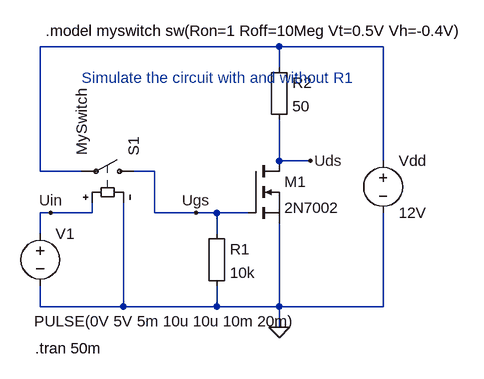
[diagram p0: schematic FET-switch-gate-protection-R.asc]
FET-switch-gate-protection-R.asc, the LTspice schematic file:
Version 4
SHEET 1 880 680
WIRE 256 48 -112 48
WIRE 416 48 256 48
WIRE 256 80 256 48
WIRE 256 224 256 160
WIRE 304 224 256 224
WIRE 416 224 416 48
WIRE -112 240 -112 48
WIRE -48 240 -112 240
WIRE 64 240 32 240
WIRE -96 304 -112 304
WIRE -32 304 -32 288
WIRE -32 304 -96 304
WIRE 64 304 64 240
WIRE 128 304 64 304
WIRE 160 304 128 304
WIRE 208 304 160 304
WIRE -112 336 -112 304
WIRE 160 336 160 304
WIRE -112 448 -112 416
WIRE 16 448 16 288
WIRE 16 448 -112 448
WIRE 160 448 160 416
WIRE 160 448 16 448
WIRE 256 448 256 320
WIRE 256 448 160 448
WIRE 416 448 416 304
WIRE 416 448 256 448
WIRE 256 480 256 448
FLAG 256 480 0
FLAG 128 304 Ugs
FLAG 304 224 Uds
FLAG -96 304 Uin
SYMBOL voltage 416 208 R0
WINDOW 123 0 0 Left 0
WINDOW 39 0 0 Left 0
SYMATTR InstName Vdd
SYMATTR Value 12V
SYMBOL nmos 208 224 R0
SYMATTR InstName M1
SYMATTR Value 2N7002
SYMBOL voltage -112 320 R0
WINDOW 3 -9 151 Left 2
WINDOW 123 0 0 Left 0
WINDOW 39 -9 169 Left 2
SYMATTR Value PULSE(0V 5V 5m 10u 10u 10m 20m)
SYMATTR InstName V1
SYMBOL Misc\\EuropeanResistor 144 320 R0
SYMATTR InstName R1
SYMATTR Value 10k
SYMBOL sw 48 240 M270
SYMATTR InstName S1
SYMATTR Value MySwitch
SYMBOL Misc\\EuropeanResistor 240 64 R0
SYMATTR InstName R2
SYMATTR Value 50
TEXT -120 512 Left 2 !.tran 50m
TEXT -104 24 Left 2 !.model myswitch sw(Ron=1 Roff=10Meg Vt=0.5V Vh=-0.4V)
TEXT -48 96 Left 2 ;Simulate the circuit with and without R1

The netlist it stands for:
* FET-switch-gate-protection-R.asc
Vdd N001 0 12V
M1 Uds Ugs 0 0 2N7002
V1 Uin 0 PULSE(0V 5V 5m 10u 10u 10m 20m)
R1 Ugs 0 10k
S1 Ugs N001 Uin 0 MySwitch
R2 N001 Uds 50
.model NMOS NMOS
.model PMOS PMOS
.lib standard.mos
.tran 50m
.model myswitch sw(Ron=1 Roff=10Meg Vt=0.5V Vh=-0.4V)
* Simulate the circuit with and without R1
.backanno
.end